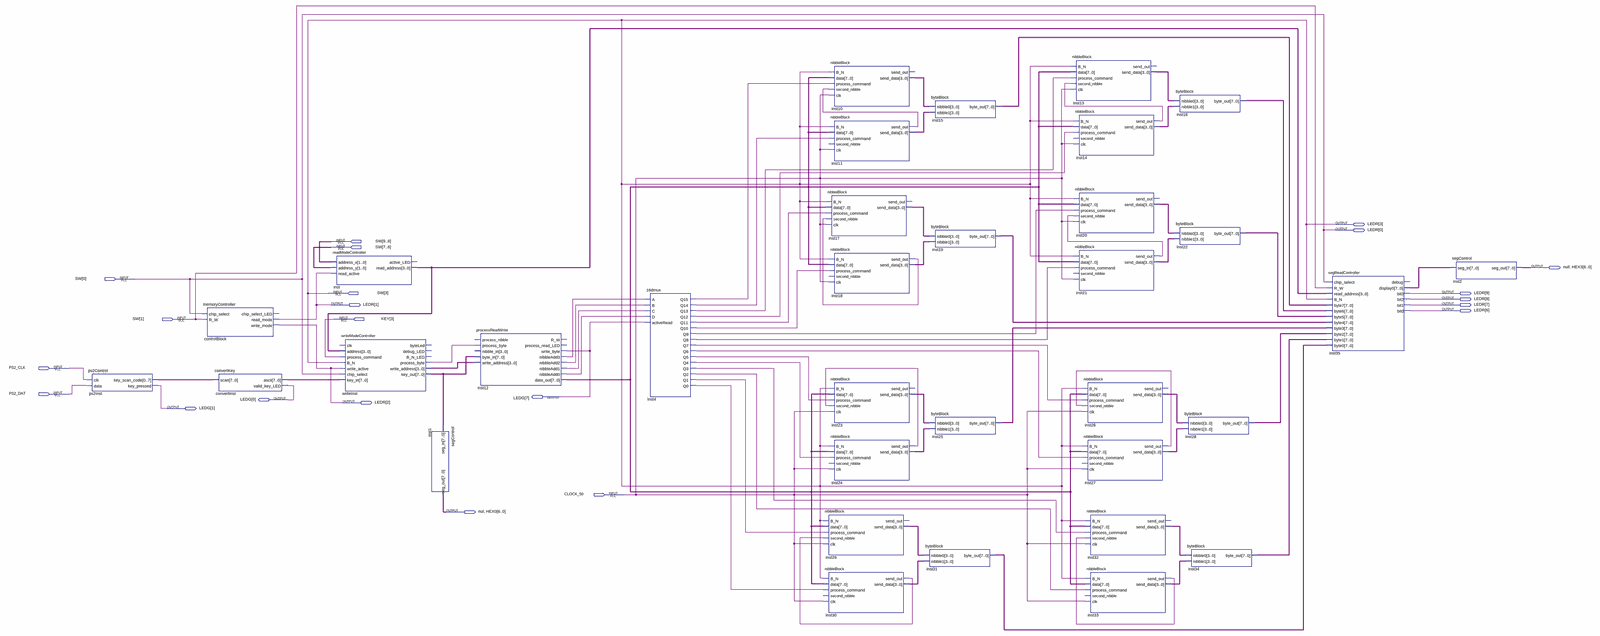
[diagram p0: schematic sheet, whole]
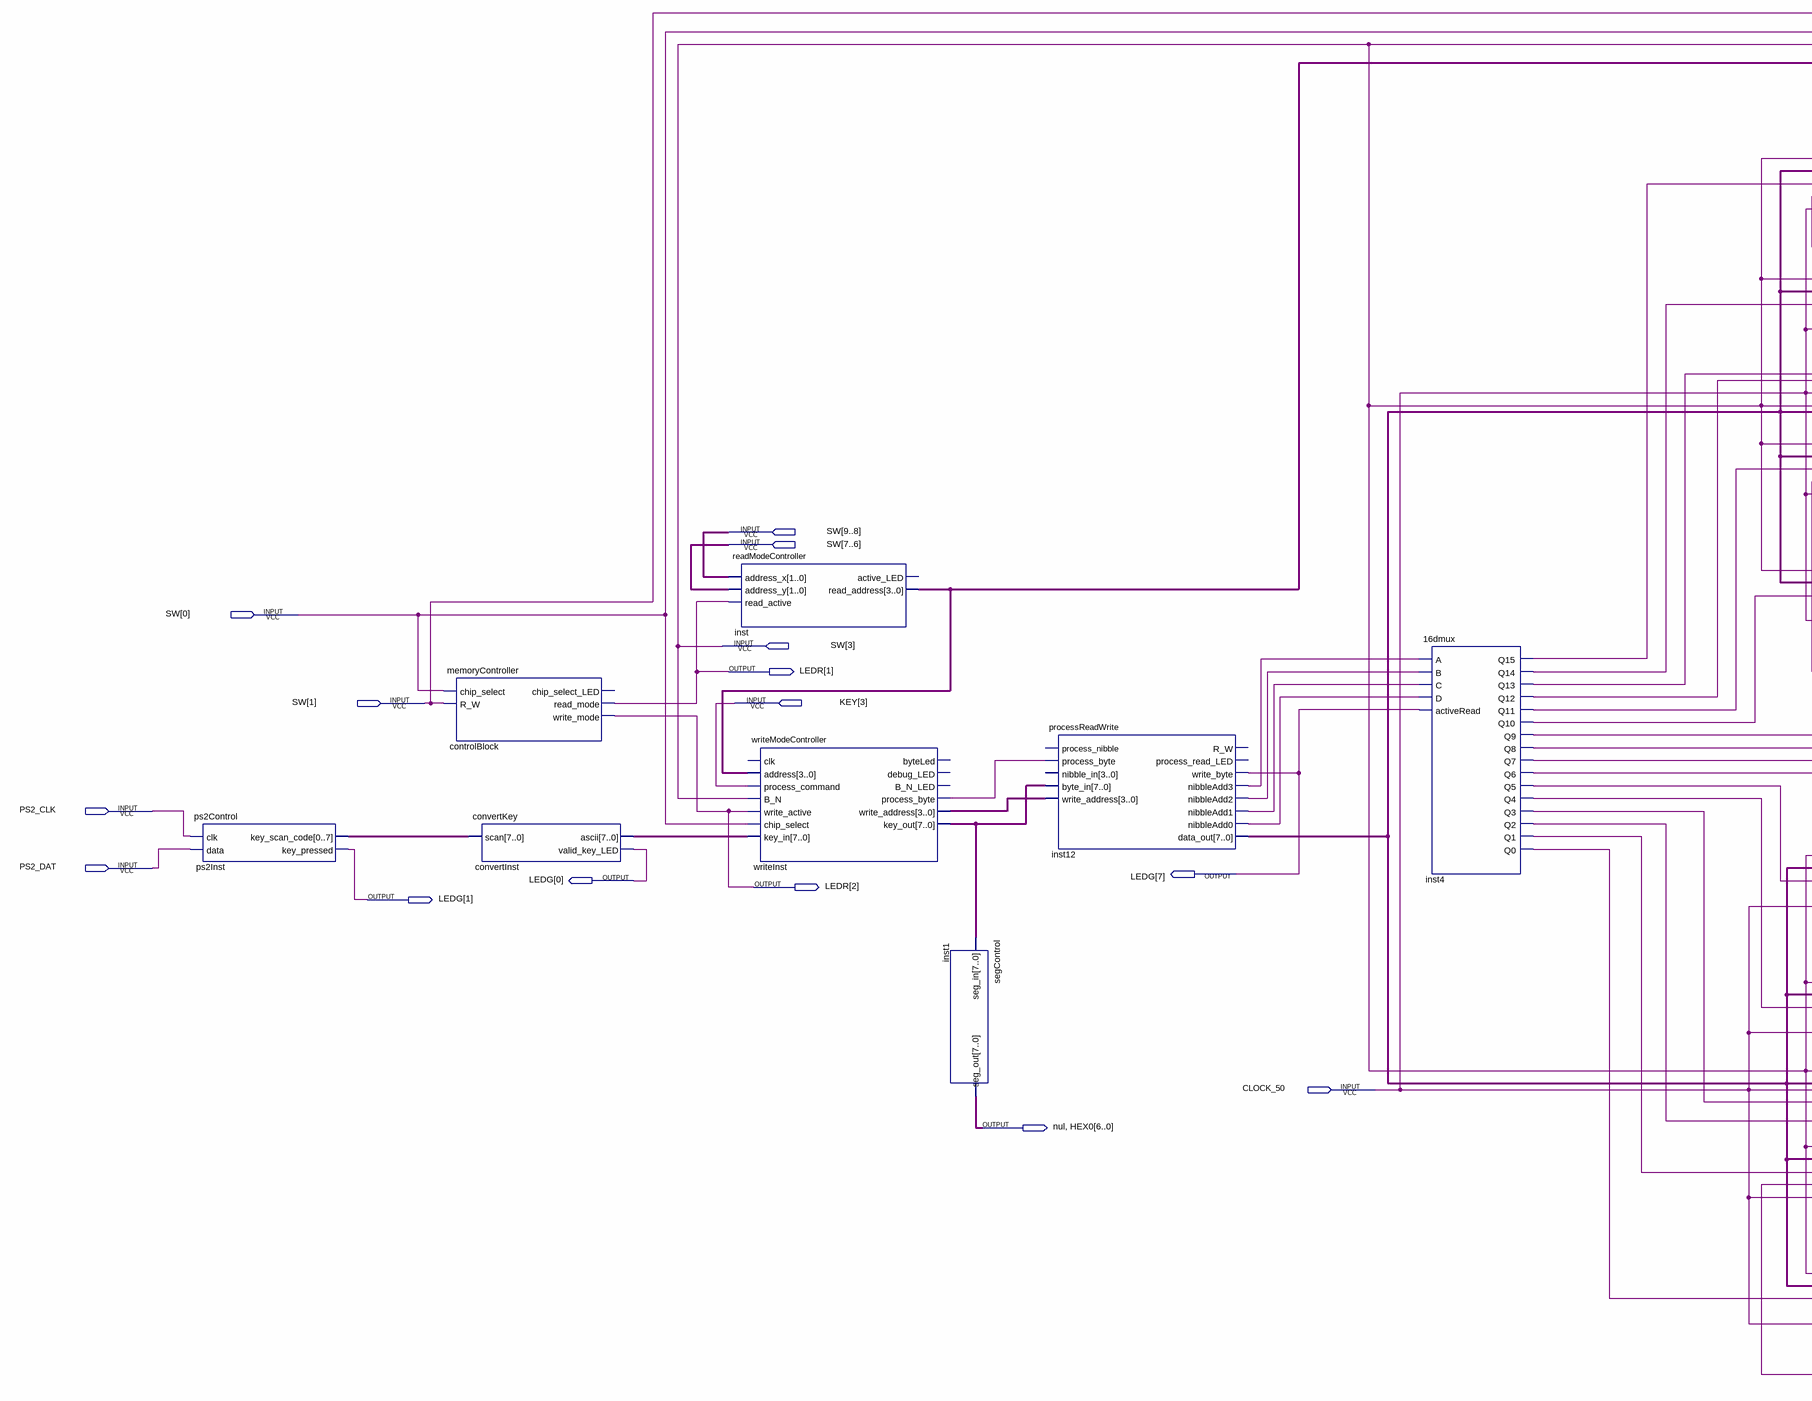
[diagram p1: schematic sheet, left part]
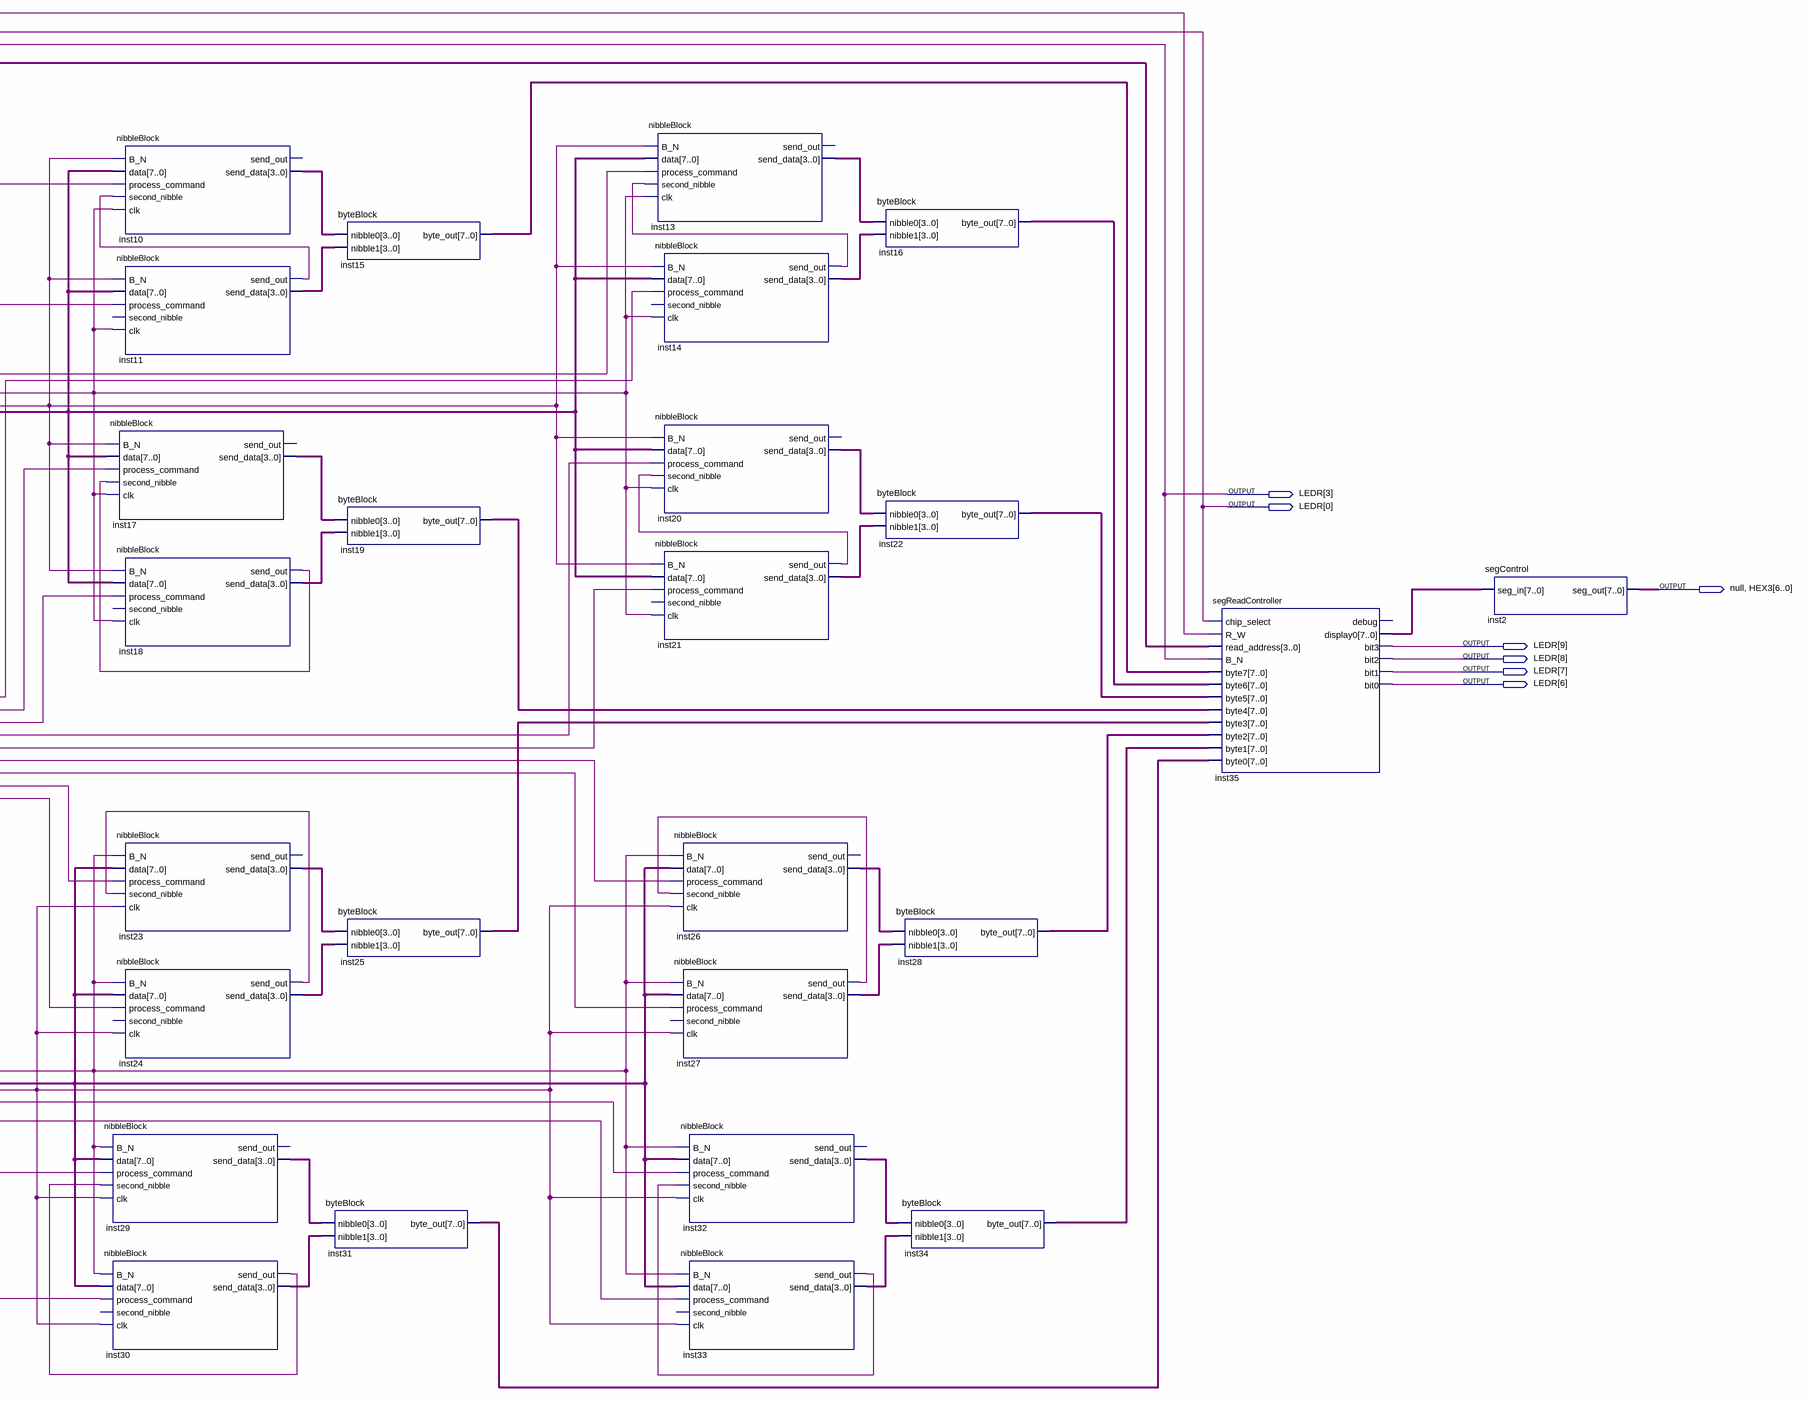
[diagram p2: schematic sheet, right part]
// Quartus schematic memory.bdf as structural Verilog: 34 symbols, 22 pins
module memory (
  input  [9:0] SW,
  input  [3:3] KEY,
  input  PS2_CLK,
  input  PS2_DAT,
  input  CLOCK_50,
  output [9:0] LEDR,
  output \null ,
  output [6:0] HEX3,
  output [7:0] LEDG,
  output nul,
  output [6:0] HEX0
);

  wire inst4_q0, inst4_q1, inst4_q2, inst4_q3, inst4_q4, inst4_q5, inst4_q6, inst4_q7, inst4_q8, inst4_q9,
       inst4_q10, inst4_q11, inst4_q12, inst4_q13, inst4_q14, inst4_q15, inst11_send_out, inst12_nibbleadd0,
       inst12_nibbleadd1, inst12_nibbleadd2, inst12_nibbleadd3, inst14_send_out, inst18_send_out,
       inst21_send_out, inst24_send_out, inst27_send_out, inst30_send_out, inst33_send_out,
       writeInst_process_byte;
  wire [3:0] inst10_send_data, inst11_send_data, inst13_send_data, inst14_send_data, inst17_send_data,
       inst18_send_data, inst20_send_data, inst21_send_data, inst23_send_data, inst24_send_data,
       inst26_send_data, inst27_send_data, inst29_send_data, inst30_send_data, inst32_send_data,
       inst33_send_data, inst_read_address, writeInst_write_address;
  wire [7:0] convertInst_ascii, inst12_data_out, inst15_byte_out, inst16_byte_out, inst19_byte_out,
       inst22_byte_out, inst25_byte_out, inst28_byte_out, inst31_byte_out, inst34_byte_out, inst35_display0,
       ps2Inst_key_scan_code, writeInst_key_out;

  ps2Control ps2Inst (.clk(PS2_CLK), .data(PS2_DAT), .key_scan_code(ps2Inst_key_scan_code), .key_pressed(LEDG[1]));
  memoryController controlBlock (
    .chip_select(SW[0]), .R_W(SW[1]), .read_mode(LEDR[1]), .write_mode(LEDR[2]));  // open: chip_select_LED
  convertKey convertInst (.scan(ps2Inst_key_scan_code), .ascii(convertInst_ascii), .valid_key_LED(LEDG[0]));
  readModeController inst (
    .address_x(SW[9:8]), .address_y(SW[7:6]), .read_active(LEDR[1]), .read_address(inst_read_address));  // open: active_LED
  writeModeController writeInst (
    .address(inst_read_address), .process_command(KEY[3]), .B_N(SW[3]), .write_active(LEDR[2]),
    .chip_select(SW[0]), .key_in(convertInst_ascii), .process_byte(writeInst_process_byte),
    .write_address(writeInst_write_address), .key_out(writeInst_key_out));  // open: clk, byteLed, debug_LED, B_N_LED
  segControl inst1 (.seg_in(writeInst_key_out), .seg_out({nul, HEX0}));
  processReadWrite inst12 (
    .process_byte(writeInst_process_byte), .byte_in(writeInst_key_out),
    .write_address(writeInst_write_address), .write_byte(LEDG[7]), .nibbleAdd3(inst12_nibbleadd3),
    .nibbleAdd2(inst12_nibbleadd2), .nibbleAdd1(inst12_nibbleadd1), .nibbleAdd0(inst12_nibbleadd0),
    .data_out(inst12_data_out));  // open: process_nibble, nibble_in, R_W, process_read_LED
  \16dmux  inst4 (
    .A(inst12_nibbleadd3), .B(inst12_nibbleadd2), .C(inst12_nibbleadd1), .D(inst12_nibbleadd0),
    .activeRead(LEDG[7]), .Q15(inst4_q15), .Q14(inst4_q14), .Q13(inst4_q13), .Q12(inst4_q12),
    .Q11(inst4_q11), .Q10(inst4_q10), .Q9(inst4_q9), .Q8(inst4_q8), .Q7(inst4_q7), .Q6(inst4_q6),
    .Q5(inst4_q5), .Q4(inst4_q4), .Q3(inst4_q3), .Q2(inst4_q2), .Q1(inst4_q1), .Q0(inst4_q0));
  nibbleBlock inst10 (
    .B_N(SW[3]), .data(inst12_data_out), .process_command(inst4_q15), .second_nibble(inst11_send_out),
    .clk(CLOCK_50), .send_data(inst10_send_data));  // open: send_out
  nibbleBlock inst11 (
    .B_N(SW[3]), .data(inst12_data_out), .process_command(inst4_q14), .clk(CLOCK_50),
    .send_out(inst11_send_out), .send_data(inst11_send_data));  // open: second_nibble
  nibbleBlock inst17 (
    .B_N(SW[3]), .data(inst12_data_out), .process_command(inst4_q11), .second_nibble(inst18_send_out),
    .clk(CLOCK_50), .send_data(inst17_send_data));  // open: send_out
  nibbleBlock inst18 (
    .B_N(SW[3]), .data(inst12_data_out), .process_command(inst4_q10), .clk(CLOCK_50),
    .send_out(inst18_send_out), .send_data(inst18_send_data));  // open: second_nibble
  nibbleBlock inst23 (
    .B_N(SW[3]), .data(inst12_data_out), .process_command(inst4_q5), .second_nibble(inst24_send_out),
    .clk(CLOCK_50), .send_data(inst23_send_data));  // open: send_out
  nibbleBlock inst24 (
    .B_N(SW[3]), .data(inst12_data_out), .process_command(inst4_q4), .clk(CLOCK_50),
    .send_out(inst24_send_out), .send_data(inst24_send_data));  // open: second_nibble
  nibbleBlock inst29 (
    .B_N(SW[3]), .data(inst12_data_out), .process_command(inst4_q1), .second_nibble(inst30_send_out),
    .clk(CLOCK_50), .send_data(inst29_send_data));  // open: send_out
  nibbleBlock inst30 (
    .B_N(SW[3]), .data(inst12_data_out), .process_command(inst4_q0), .clk(CLOCK_50),
    .send_out(inst30_send_out), .send_data(inst30_send_data));  // open: second_nibble
  byteBlock inst31 (.nibble0(inst29_send_data), .nibble1(inst30_send_data), .byte_out(inst31_byte_out));
  byteBlock inst15 (.nibble0(inst10_send_data), .nibble1(inst11_send_data), .byte_out(inst15_byte_out));
  byteBlock inst19 (.nibble0(inst17_send_data), .nibble1(inst18_send_data), .byte_out(inst19_byte_out));
  byteBlock inst25 (.nibble0(inst23_send_data), .nibble1(inst24_send_data), .byte_out(inst25_byte_out));
  nibbleBlock inst13 (
    .B_N(SW[3]), .data(inst12_data_out), .process_command(inst4_q13), .second_nibble(inst14_send_out),
    .clk(CLOCK_50), .send_data(inst13_send_data));  // open: send_out
  nibbleBlock inst14 (
    .B_N(SW[3]), .data(inst12_data_out), .process_command(inst4_q12), .clk(CLOCK_50),
    .send_out(inst14_send_out), .send_data(inst14_send_data));  // open: second_nibble
  nibbleBlock inst20 (
    .B_N(SW[3]), .data(inst12_data_out), .process_command(inst4_q9), .second_nibble(inst21_send_out),
    .clk(CLOCK_50), .send_data(inst20_send_data));  // open: send_out
  nibbleBlock inst21 (
    .B_N(SW[3]), .data(inst12_data_out), .process_command(inst4_q8), .clk(CLOCK_50),
    .send_out(inst21_send_out), .send_data(inst21_send_data));  // open: second_nibble
  nibbleBlock inst26 (
    .B_N(SW[3]), .data(inst12_data_out), .process_command(inst4_q7), .second_nibble(inst27_send_out),
    .clk(CLOCK_50), .send_data(inst26_send_data));  // open: send_out
  nibbleBlock inst27 (
    .B_N(SW[3]), .data(inst12_data_out), .process_command(inst4_q6), .clk(CLOCK_50),
    .send_out(inst27_send_out), .send_data(inst27_send_data));  // open: second_nibble
  nibbleBlock inst32 (
    .B_N(SW[3]), .data(inst12_data_out), .process_command(inst4_q3), .second_nibble(inst33_send_out),
    .clk(CLOCK_50), .send_data(inst32_send_data));  // open: send_out
  nibbleBlock inst33 (
    .B_N(SW[3]), .data(inst12_data_out), .process_command(inst4_q2), .clk(CLOCK_50),
    .send_out(inst33_send_out), .send_data(inst33_send_data));  // open: second_nibble
  byteBlock inst16 (.nibble0(inst13_send_data), .nibble1(inst14_send_data), .byte_out(inst16_byte_out));
  byteBlock inst22 (.nibble0(inst20_send_data), .nibble1(inst21_send_data), .byte_out(inst22_byte_out));
  byteBlock inst28 (.nibble0(inst26_send_data), .nibble1(inst27_send_data), .byte_out(inst28_byte_out));
  byteBlock inst34 (.nibble0(inst32_send_data), .nibble1(inst33_send_data), .byte_out(inst34_byte_out));
  segReadController inst35 (
    .chip_select(SW[0]), .R_W(SW[1]), .read_address(inst_read_address), .B_N(SW[3]), .byte7(inst15_byte_out),
    .byte6(inst16_byte_out), .byte5(inst22_byte_out), .byte4(inst19_byte_out), .byte3(inst25_byte_out),
    .byte2(inst28_byte_out), .byte1(inst34_byte_out), .byte0(inst31_byte_out), .display0(inst35_display0),
    .bit3(LEDR[9]), .bit2(LEDR[8]), .bit1(LEDR[7]), .bit0(LEDR[6]));  // open: debug
  segControl inst2 (.seg_in(inst35_display0), .seg_out({\null , HEX3}));

  assign {LEDR[3], LEDR[0]} = {SW[3], SW[0]};
endmodule
